# Altium schematic sheet GPS_Schematic_Rev2.2.SchDoc: GPS Board
size A2; Date: Oct 23, 2014; Author: MR; DrawnBy: Mike Rankin; Revision: 2.1; SheetNumber: 1; SheetTotal: 1; CurrentDate: Oct 23, 2014; ProjectName: GPS Board
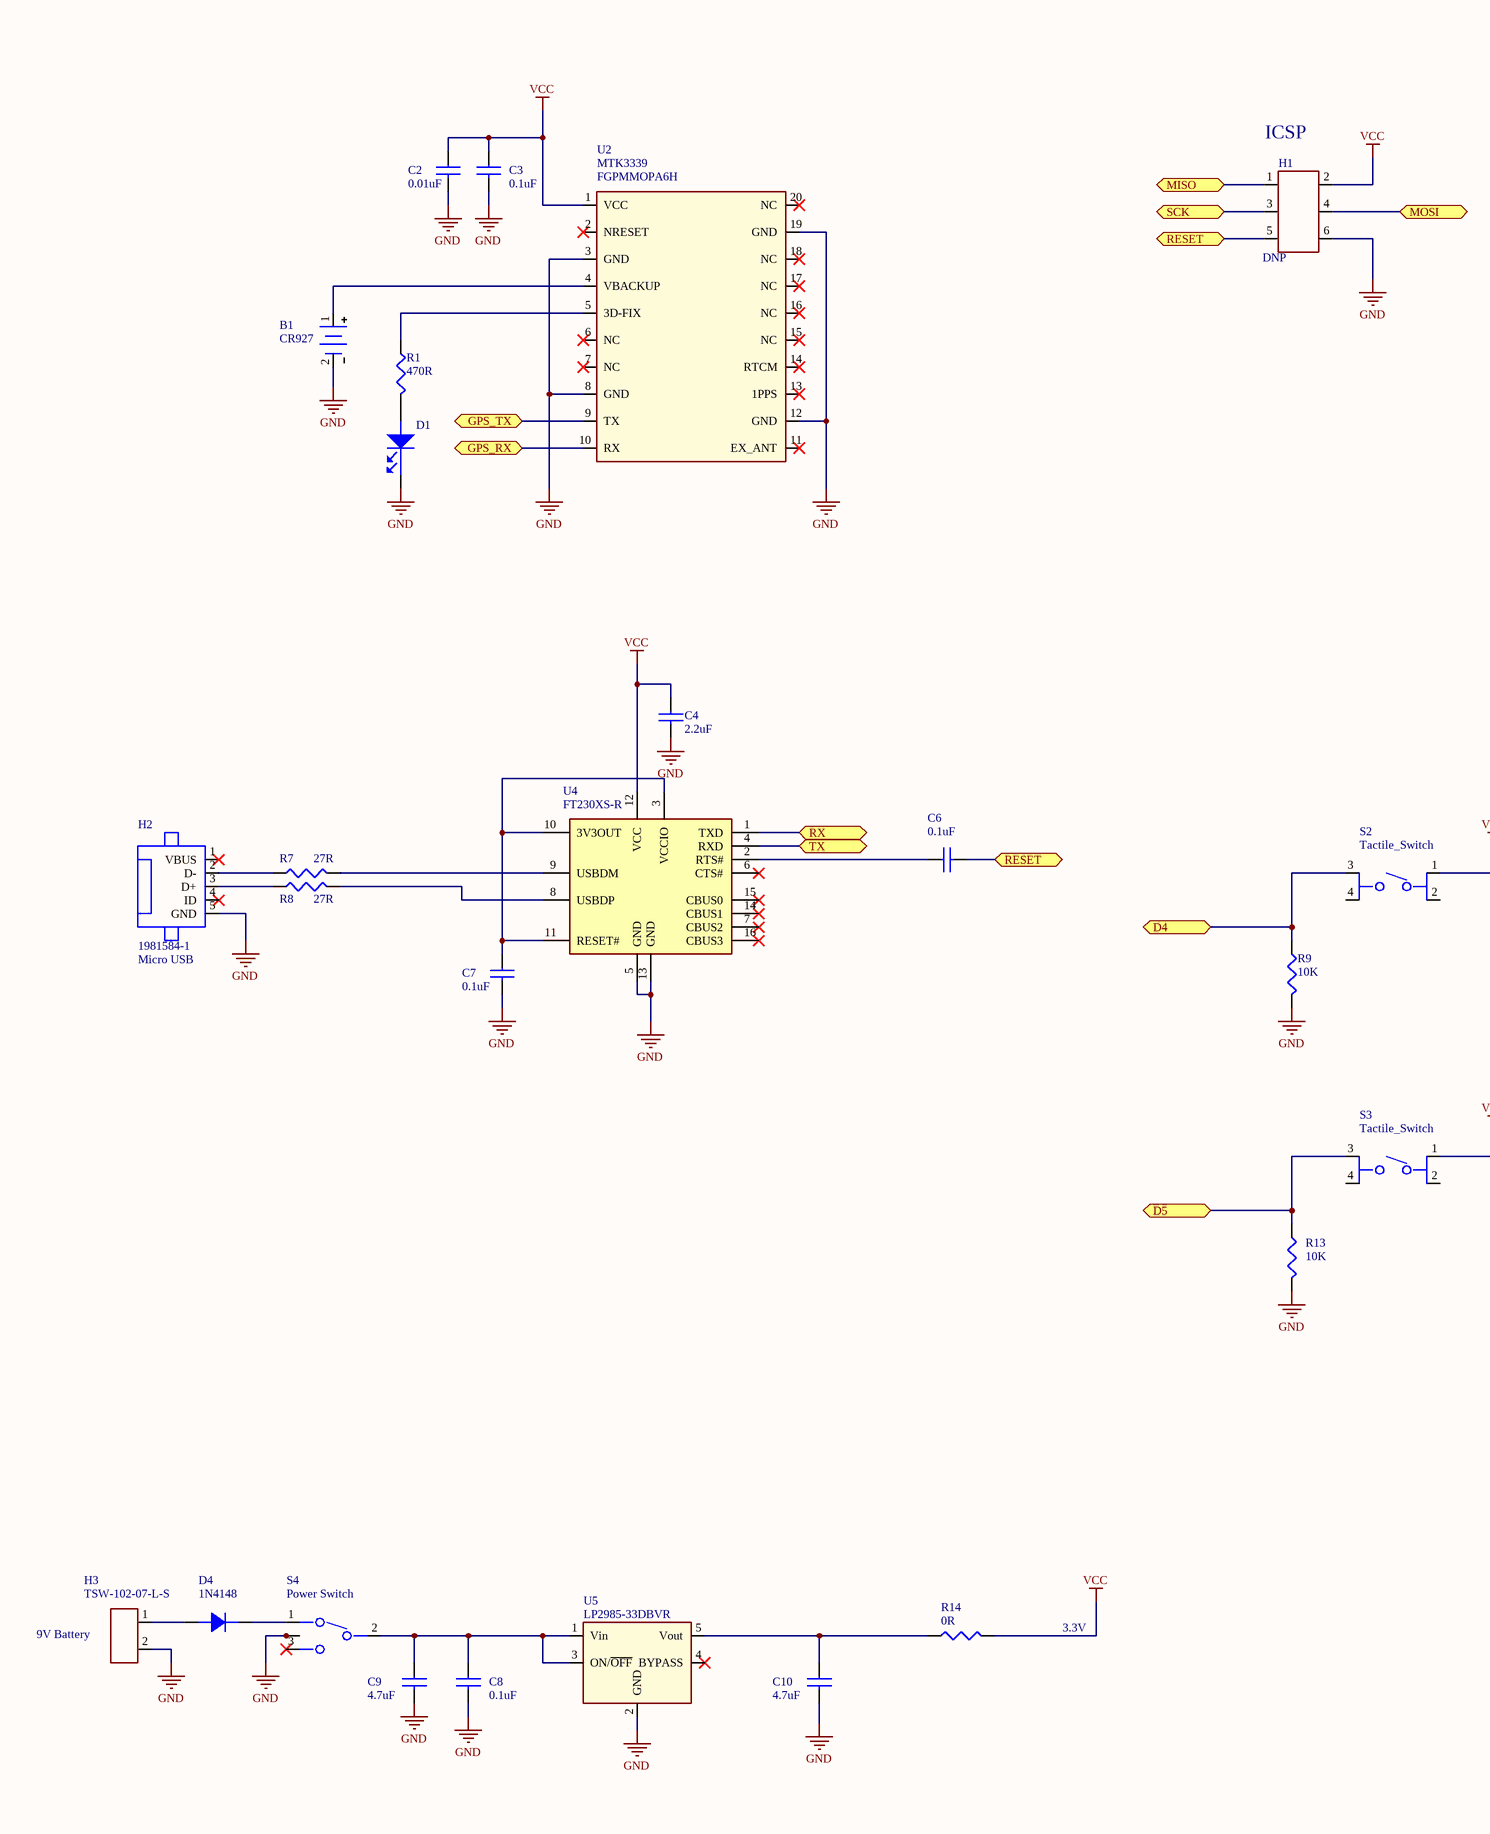
[diagram p0: GPS_Schematic_Rev2.2.SchDoc, left]
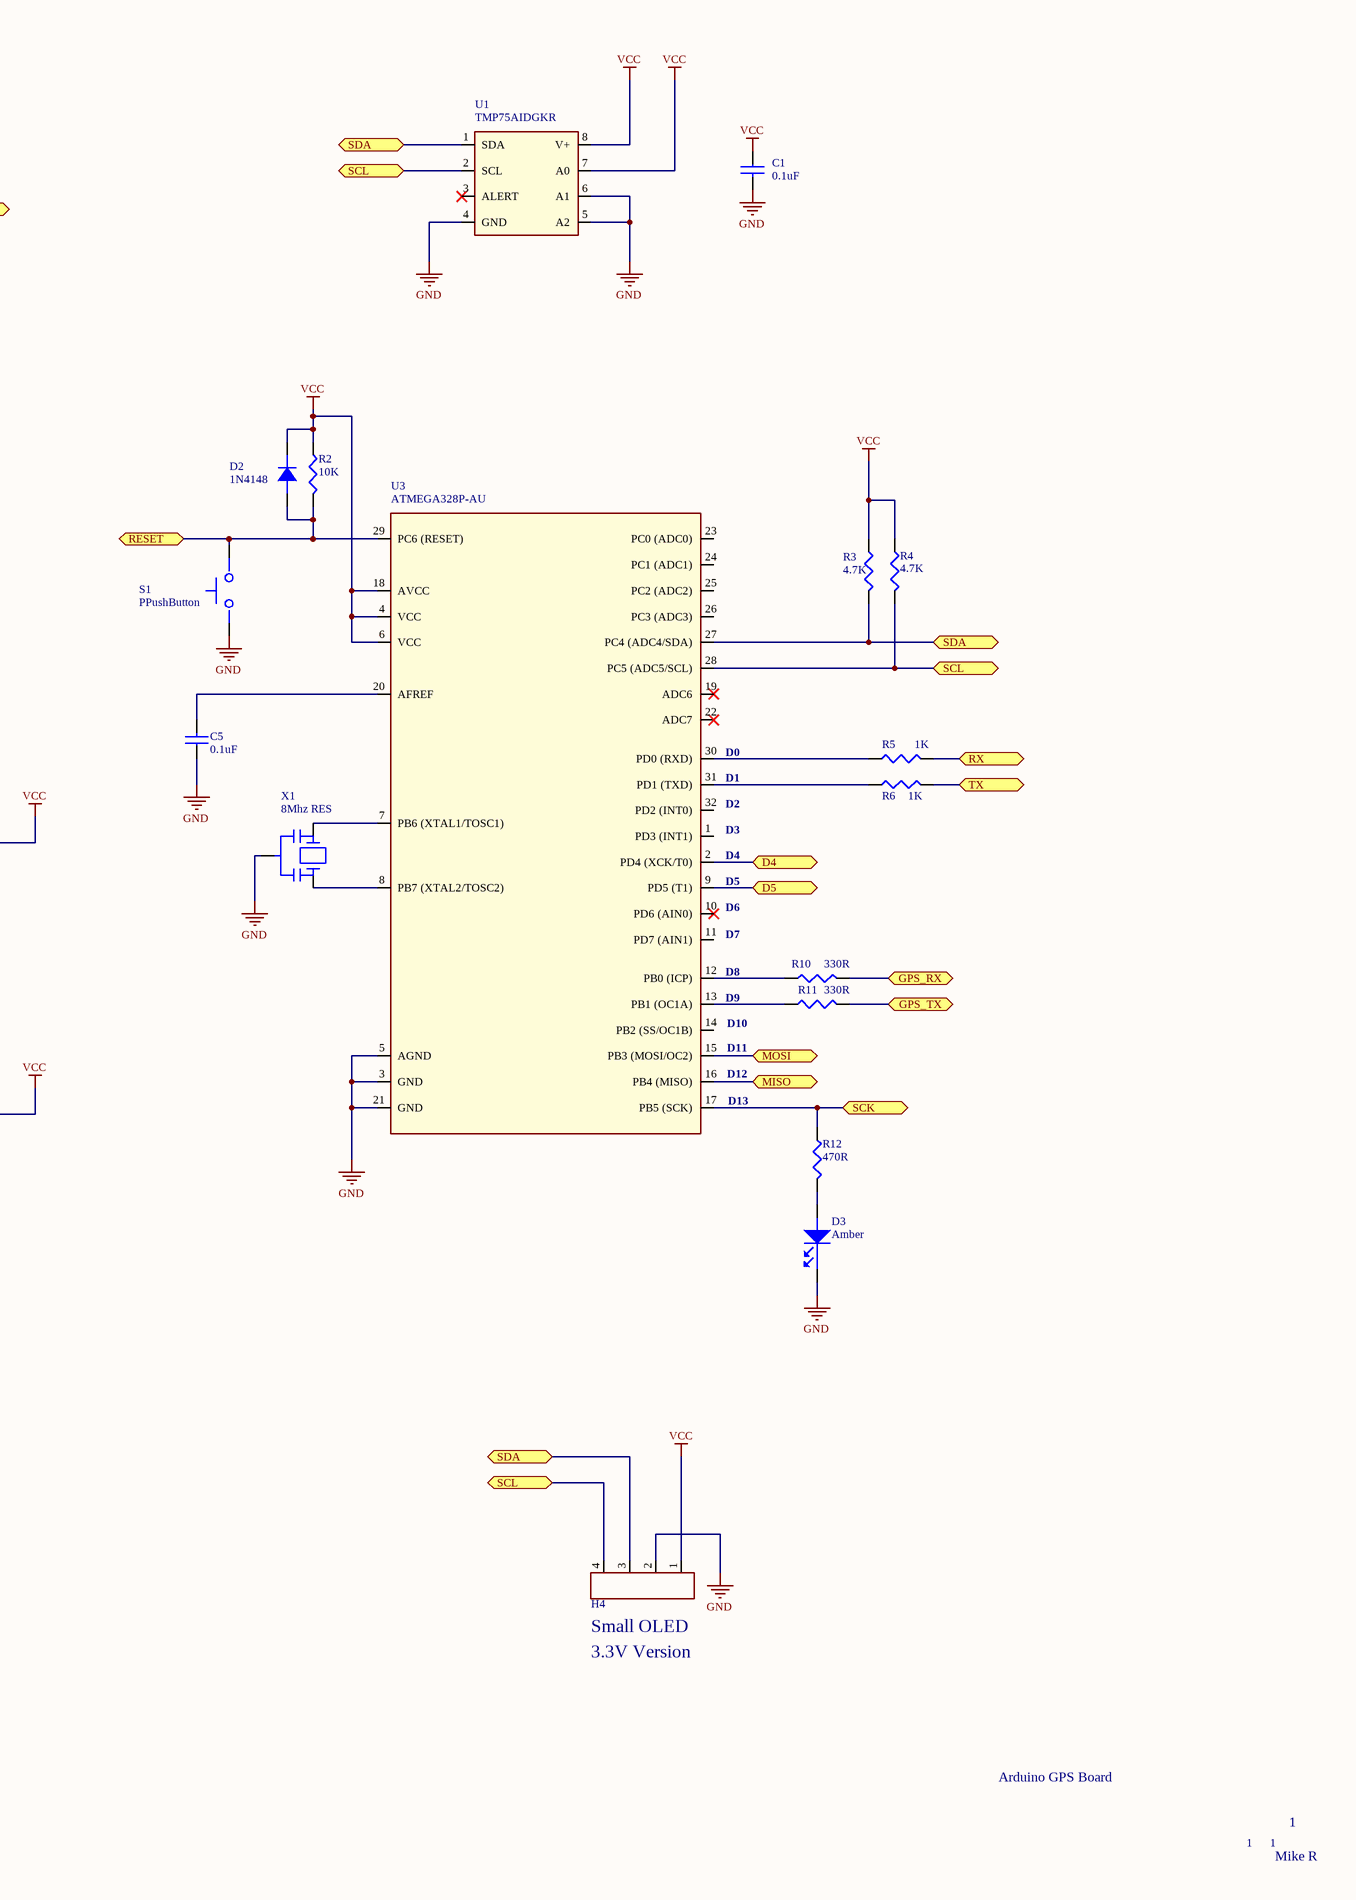
[diagram p1: GPS_Schematic_Rev2.2.SchDoc, right]

## Parts
B1  CR927  [CR927 Mount]
C1  value 0.1uF  [CAPC1608X09L]
C2  0.01uF  [CAPC1608X09L]
C3  value 0.1uF  [CAPC1608X09L]
C4  2.2uF  [CAPC1608X09L]
C5  value 0.1uF  [CAPC1608X09L]
C6  value 0.1uF  [CAPC1608X09L]
C7  0.1uF  [CAPC1608X09L]
C8  value 0.1uF  [CAPC1608X09L]
C9  value 4.7uF  [CAPC3216X160L]  (hidden comment: CAP_1206)
C10  value 4.7uF  [CAPC3216X160L]  (hidden comment: CAP_1206)
D1  Green LED  [LED1608X55N-GREEN]  (value not drawn)
D2  1N4148  [SOD123]
D3  PartNumber: Amber  [LED1608X55N-YELLOW]  (hidden comment: LED_0603)
D4  1N4148  [SOD123]
H1  DNP  [HDR3X2]
H2  Micro USB  [1981584-1]
H3  TSW-102-07-L-S  [HDR1X2]
H4  TSW-104-07-L-S  [HDR1X4-Empty]  (value not drawn)
R1  470R  [RESC1608X06L]
R2  10K  [RESC1608X06L]
R3  4.7K  [RESC1608X06L]
R4  4.7K  [RESC1608X06L]
R5  1K  [RESC1608X06L]
R6  1K  [RESC1608X06L]
R7  27R  [RESC1608X06L]
R8  27R  [RESC1608X06L]
R9  10K  [RESC1608X06L]
R10  330R  [RESC1608X06L]
R11  330R  [RESC1608X06L]
R12  470R  [RESC1608X06L]
R13  10K  [RESC1608X06L]
R14  0R  [RESC1608X06L]
S1  PPushButton  [TL1015AF160QG]
S2  Tactile_Switch  [FSM6JSMA]
S3  Tactile_Switch  [FSM6JSMA]
S4  (no value)  [SLIDE_SWITCH_DX]
U1  TMP75AIDGKR  [MSOP-8N - NOPAD]
U2  MTK3339  [FGPMMOPA6H]
U3  ATMEGA328P-AU  [TQFP80P700X700-32N]
U4  FT230XS-R  [SOP65P602X173-16N]
U5  LP2985-33DBVR  [SOT95P280X144-5N]
X1  value 8Mhz RES  [CSTCE]

## Ports
D4 (bidir), D5, GPS_RX (bidir), GPS_TX, MISO (bidir), MOSI (bidir), RESET (bidir), RX (bidir), SCK (bidir), SCL (bidir), SDA (bidir), TX (bidir)

## Nets
GND: B1.2(-) C1.2 C2.2 C3.2 C4.2 C5.1 C7.2 C8.2 C9.2 C10.2 D1.1(CATHODE) D3.1(CATHODE) H1.6 H2.5(GND) H3.2 H4.2 R9.2 R13.2 S1.1(A) S4.4(GND) S4.5(GND) U1.4(GND) U1.5(A2) U1.6(A1) U2.3(GND) U2.8(GND) U2.12(GND) U2.19(GND) U3.3(GND) U3.5(AGND) U3.21(GND) U4.5(GND) U4.13(GND) U5.2(GND) X1.2
VCC: C1.1 C2.1 C3.1 C4.1 D2.1(Cathode) H1.2 H4.1 R2.1 R3.1 R4.1 R14.2 S2.1 S3.1 U1.7(A0) U1.8(V+) U2.1(VCC) U3.4(VCC) U3.6(VCC) U3.18(AVCC) U4.12(VCC)
D4: R9.1 S2.3 U3.2(PD4_(XCK/T0)) ; port D4
D5: R13.1 S3.3 U3.9(PD5_(T1)) ; port D5
GPS_RX: R10.2 U2.10(RX) ; port GPS_RX
GPS_TX: R11.2 U2.9(TX) ; port GPS_TX
MISO: H1.1 U3.16(PB4_(MISO)) ; port MISO
MOSI: H1.4 U3.15(PB3_(MOSI/OC2)) ; port MOSI
RESET: C6.2 D2.2(Annode) H1.5 R2.2 S1.2(B) U3.29(PC6_(RESET)) ; port RESET
RX: R5.2 U4.1(TXD) ; port RX
SCK: H1.3 R12.1 U3.17(PB5_(SCK)) ; port SCK
SCL: H4.4 R4.2 U1.2(SCL) U3.28(PC5_(ADC5/SCL)) ; port SCL
SDA: H4.3 R3.2 U1.1(SDA) U3.27(PC4_(ADC4/SDA)) ; port SDA
TX: R6.2 U4.4(RXD) ; port TX
NetB1_1: B1.1(+) U2.4(VBACKUP)
NetC5_2: C5.2 U3.20(AFREF)
NetC6_1: C6.1 U4.2(RTS#)
NetC7_1: C7.1 U4.3(VCCIO) U4.10(3V3OUT) U4.11(RESET#)
NetC8_1: C8.1 C9.1 S4.2(Middle) U5.1(Vin) U5.3(ON/~{OFF})
NetC10_1: C10.1 R14.1 U5.5(Vout)
NetD1_2: D1.2(ANODE) R1.2
NetD3_2: D3.2(ANODE) R12.2
NetD4_1: D4.1(Cathode) S4.1(A)
NetD4_2: D4.2(Annode) H3.1
NetH2_2: H2.2(D-) R7.1
NetH2_3: H2.3(D+) R8.1
NetR1_1: R1.1 U2.5(3D-FIX)
NetR5_1: R5.1 U3.30(PD0_(RXD))
NetR6_1: R6.1 U3.31(PD1_(TXD))
NetR7_2: R7.2 U4.9(USBDM)
NetR8_2: R8.2 U4.8(USBDP)
NetR10_1: R10.1 U3.12(PB0_(ICP))
NetR11_1: R11.1 U3.13(PB1_(OC1A))
NetU3_7: U3.7(PB6_(XTAL1/TOSC1)) X1.1
NetU3_8: U3.8(PB7_(XTAL2/TOSC2)) X1.3

Not connected (* = marked no-connect by the designer): H2 1(VBUS)* 4(ID)*; S2 2 4; S3 2 4; S4 3(B)*; U1 3(ALERT)*; U2 2(NRESET)* 6(NC)* 7(NC)* 11(EX_ANT)* 13(1PPS)* 14(RTCM)* 15(NC)* 16(NC)* 17(NC)* 18(NC)* 20(NC)*; U3 1(PD3_(INT1)) 10(PD6_(AIN0))* 11(PD7_(AIN1)) 14(PB2_(SS/OC1B)) 19(ADC6)* 22(ADC7)* 23(PC0_(ADC0)) 24(PC1_(ADC1)) 25(PC2_(ADC2)) 26(PC3_(ADC3)) 32(PD2_(INT0)); U4 6(CTS#)* 7(CBUS2)* 14(CBUS1)* 15(CBUS0)* 16(CBUS3)*; U5 4(BYPASS)*

## Notes on the sheet
- (near H1) ICSP
- (near U3) D0
- (near U3) D2
- (near U3) D1
- (near U3) D5
- (near U3) D4
- (near U3) D3
- (near U3) D7
- (near U3) D6
- (near U3) D9
- (near U3) D8
- (near U3) D12
- (near U3) D11
- (near U3) D10
- (near U3) D13
- (near S4) Power Switch
- (near H3) 9V Battery
- 3.3V
- (near H4) Small OLED
- 3.3V Version
- Arduino GPS Board
- 1
- Mike R

## Library data of the parts
B1 = CR927: Custom CR927 mount; PartNumber: 202984; Vendor: DX.com; Value: CR927
C1 C3 C5-C8 = CAP_0603: CAP CER 0.1uF, 0603
  C7: Value: 0.1uF
C2 = CAP_0603: CAP CER 0.01uF, 0603; Value: 0.01uF
C4 = CAP_0805: 2.2uF, 0602; Value: 2.2uF
C9 C10 = CAP_1206: CAP CER 4.7uF, 1206
D1 = LED_0603: Value: Green LED
D2 D4 = 1N4148W-TP: DIODE SWITCH 100V 0.15A SOD123; Manufacturer: Micro Commercial; Vendor: Digikey; PartNumber: 1N4148W-TP; Value: 1N4148
H1 = CON3X2: CONN HEADER 3X2POS .100" PADS; PartNumber: DNP; Value: DNP
H2 = 1981584-1: CONN RCPT MICRO USB TYPE AB; Manufacturer: TE Connectivity; Vendor: Digi-Key; PartNumber: 1981584-1; Value: Micro USB
H3 = TSW-102-07-L-S: CONN HEADER 2POS .100" SGL GOLD; Available From: Samtec; Data Sheet: http://www.samtec.com/ProductInformation/TechnicalSpecifications/Overview.aspx?series=TSW; Exact Part Number: TSW-102-07-L-S; Manufacturer: Samtec; Operating Temp: *; Order Part Number: TSW-102-07-L-S; Price: $0.51; ROHS Compliant: Yes; Voltage/Pwr: *
H4 = TSW-104-07-L-S: CONN HEADER 4POS .100" SGL GOLD; Available From: Samtec; Data Sheet: http://www.samtec.com/ProductInformation/TechnicalSpecifications/Overview.aspx?series=TSW; Exact Part Number: TSW-104-07-L-S; Manufacturer: Samtec; Operating Temp: *; Order Part Number: TSW-104-07-L-S; Price: $0.64; ROHS Compliant: Yes; Voltage/Pwr: *
R1-R14 = RES_0603: RES 0603
  R1 R12: Value: 470R
  R2 R9 R13: Value: 10K
  R3 R4: Value: 4.7K
  R5 R6: Value: 1K
  R7 R8: Value: 27R
  R10 R11: Value: 330R
  R14: Value: 0R
S1 = DX_MINI_TACT_SWITCH: DX_SWITCH TACTILE; PartNumber: 122514; Value: Mini PushButton
S2 S3 = FSM6JSMA: SWITCH TACTILE SPST-NO 0.05A 12V; Manufacturer: TE Connectivity; Vendor: Digikey; PartNumber: FSM6JSMA; Value: FSM6JSMA
S4 = DX_SLIDE_SWITCH: DX_SWITCH SLIDE SPDT R/A; PartNumber: 122531; Vendor: DX.com; Value: DX_SLIDE_SWITCH
U1 = TMP75AIDGKR: IC DGTL TEMP SENSOR 2WIRE 8-MSOP; Manufacturer: Maxim; Vendor: Digikey; Value: TMP75AIDGKR; PartNumber: TMP75AIDGKR
U2 = MTK3339: GPS Chip - FGPMMOPA6H; Manufacturer: Global Top; Value: MTK3339; PartNumber: FGPMMOPA6H
U3 = ATMEGA328P-AU: MCU AVR 32K FLASH 32TQFP; Manufacturer: Atmel; Vendor: Digikey; PartNumber: ATMEGA328P-AU
U4 = FT230XS-R: IC USB SERIAL BASIC UART 16SSOP; Manufacturer: FTDI; Vendor: Digikey; PartNumber: FT230XS-R
U5 = LP2985-33DBVR: IC REG LDO 3.3V .15A SOT23-5; Manufacturer: Texas Instruments; Vendor: Digikey; PartNumber: LP2985-33DBVR
X1 = CSTCE8M00G55-R0: CER RESONATOR 8.0MHZ SMD; Manufacturer: Murata; Vendor: Digikey; PartNumber: CSTCE8M00G55-R0